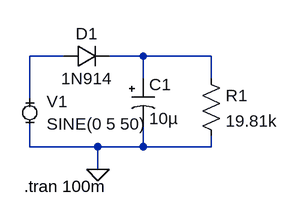
[diagram p0: schematic lab2_1.asc]
lab2_1.asc, the LTspice schematic file:
Version 4
SHEET 1 880 680
WIRE 128 80 80 80
WIRE 240 80 192 80
WIRE 336 80 240 80
WIRE 240 112 240 80
WIRE 336 112 336 80
WIRE 80 144 80 80
WIRE 80 208 80 176
WIRE 176 208 80 208
WIRE 240 208 240 176
WIRE 240 208 176 208
WIRE 336 208 336 192
WIRE 336 208 240 208
WIRE 176 240 176 208
FLAG 176 240 0
SYMBOL MiniSyms4\\voltage- 80 160 R0
WINDOW 123 0 0 Left 2
WINDOW 39 0 0 Left 2
SYMATTR InstName V1
SYMATTR Value SINE(0 5 50)
SYMBOL diode 128 96 R270
WINDOW 0 32 32 VTop 2
WINDOW 3 0 32 VBottom 2
SYMATTR InstName D1
SYMATTR Value 1N914
SYMBOL polcap 224 112 R0
WINDOW 3 24 56 Left 2
SYMATTR Value 10µ
SYMATTR InstName C1
SYMATTR Description Capacitor
SYMATTR Type cap
SYMATTR SpiceLine V=25 Irms=35m Rser=2.8 Lser=0
SYMBOL res 320 96 R0
SYMATTR InstName R1
SYMATTR Value 19.81k
TEXT 72 264 Left 2 !.tran 100m

The netlist it stands for:
* lab2_1.asc
V1 N001 0 SINE(0 5 50)
D1 N001 N002 1N914
C1 N002 0 10µ V=25 Irms=35m Rser=2.8 Lser=0
R1 N002 0 19.81k
.model D D
.lib standard.dio
.tran 100m
.backanno
.end